# EAGLE design S151A (EAGLE 6.6.0)
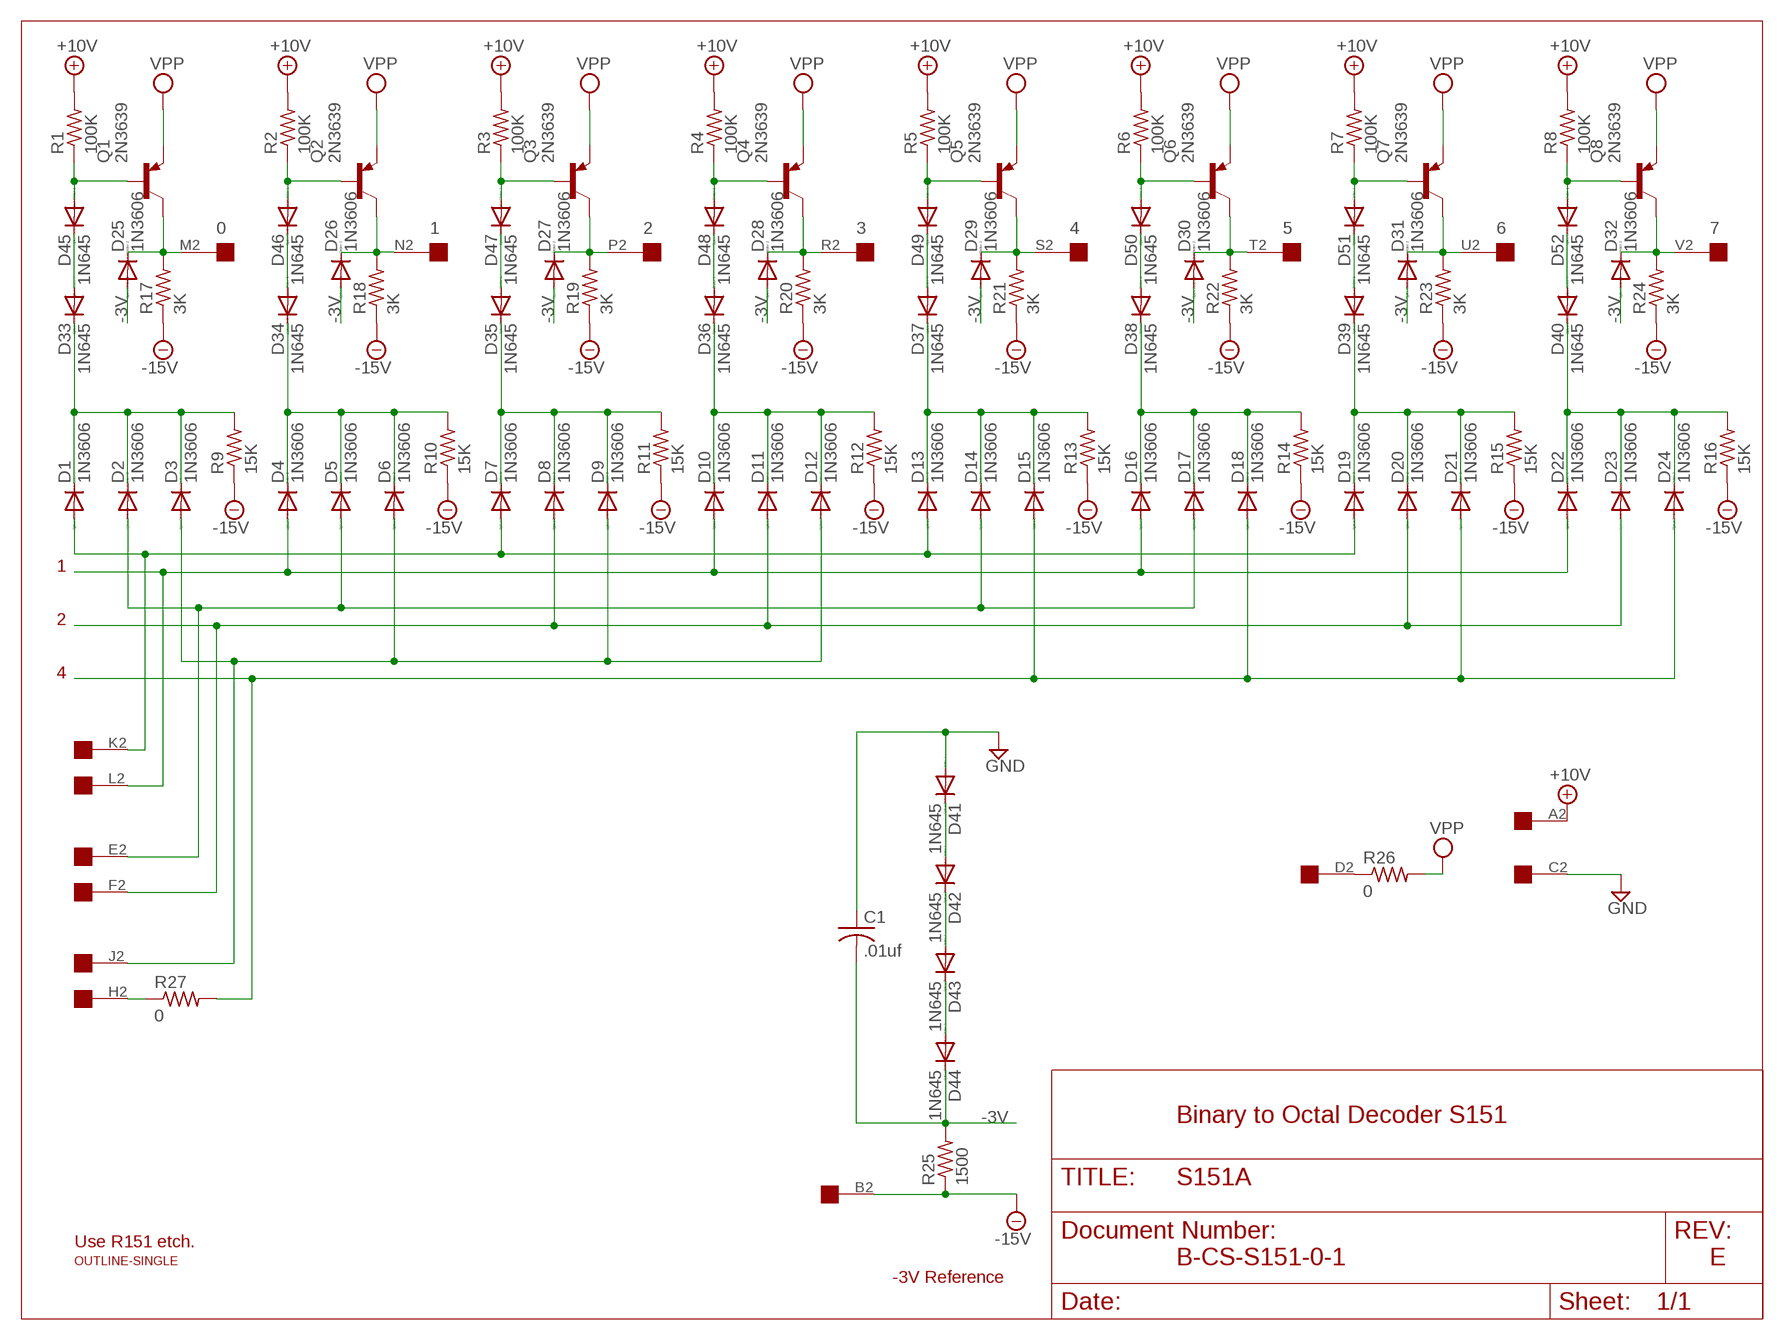
[diagram p0: schematic, sheet 1]

## Parts
C1  .01uf  C-US050-025X075  [C050-025X075]
D1  1N3606  1N4148DO35-10  [DO35-10]
D2  1N3606  1N4148DO35-10  [DO35-10]
D3  1N3606  1N4148DO35-10  [DO35-10]
D4  1N3606  1N4148DO35-10  [DO35-10]
D5  1N3606  1N4148DO35-10  [DO35-10]
D6  1N3606  1N4148DO35-10  [DO35-10]
D7  1N3606  1N4148DO35-10  [DO35-10]
D8  1N3606  1N4148DO35-10  [DO35-10]
D9  1N3606  1N4148DO35-10  [DO35-10]
D10  1N3606  1N4148DO35-10  [DO35-10]
D11  1N3606  1N4148DO35-10  [DO35-10]
D12  1N3606  1N4148DO35-10  [DO35-10]
D13  1N3606  1N4148DO35-10  [DO35-10]
D14  1N3606  1N4148DO35-10  [DO35-10]
D15  1N3606  1N4148DO35-10  [DO35-10]
D16  1N3606  1N4148DO35-10  [DO35-10]
D17  1N3606  1N4148DO35-10  [DO35-10]
D18  1N3606  1N4148DO35-10  [DO35-10]
D19  1N3606  1N4148DO35-10  [DO35-10]
D20  1N3606  1N4148DO35-10  [DO35-10]
D21  1N3606  1N4148DO35-10  [DO35-10]
D22  1N3606  1N4148DO35-10  [DO35-10]
D23  1N3606  1N4148DO35-10  [DO35-10]
D24  1N3606  1N4148DO35-10  [DO35-10]
D25  1N3606  1N4148DO35-10  [DO35-10]
D26  1N3606  1N4148DO35-10  [DO35-10]
D27  1N3606  1N4148DO35-10  [DO35-10]
D28  1N3606  1N4148DO35-10  [DO35-10]
D29  1N3606  1N4148DO35-10  [DO35-10]
D30  1N3606  1N4148DO35-10  [DO35-10]
D31  1N3606  1N4148DO35-10  [DO35-10]
D32  1N3606  1N4148DO35-10  [DO35-10]
D33  1N645  1N4148DO35-10  [DO35-10]
D34  1N645  1N4148DO35-10  [DO35-10]
D35  1N645  1N4148DO35-10  [DO35-10]
D36  1N645  1N4148DO35-10  [DO35-10]
D37  1N645  1N4148DO35-10  [DO35-10]
D38  1N645  1N4148DO35-10  [DO35-10]
D39  1N645  1N4148DO35-10  [DO35-10]
D40  1N645  1N4148DO35-10  [DO35-10]
D41  1N645  1N4148DO35-10  [DO35-10]
D42  1N645  1N4148DO35-10  [DO35-10]
D43  1N645  1N4148DO35-10  [DO35-10]
D44  1N645  1N4148DO35-10  [DO35-10]
D45  1N645  1N4148DO35-10  [DO35-10]
D46  1N645  1N4148DO35-10  [DO35-10]
D47  1N645  1N4148DO35-10  [DO35-10]
D48  1N645  1N4148DO35-10  [DO35-10]
D49  1N645  1N4148DO35-10  [DO35-10]
D50  1N645  1N4148DO35-10  [DO35-10]
D51  1N645  1N4148DO35-10  [DO35-10]
D52  1N645  1N4148DO35-10  [DO35-10]
Q1  2N3639  2N3637  [TO39]
Q2  2N3639  2N3637  [TO39]
Q3  2N3639  2N3637  [TO39]
Q4  2N3639  2N3637  [TO39]
Q5  2N3639  2N3637  [TO39]
Q6  2N3639  2N3637  [TO39]
Q7  2N3639  2N3637  [TO39]
Q8  2N3639  2N3637  [TO39]
R1  100K  R-US_0207/10  [0207/10]
R2  100K  R-US_0207/10  [0207/10]
R3  100K  R-US_0207/10  [0207/10]
R4  100K  R-US_0207/10  [0207/10]
R5  100K  R-US_0207/10  [0207/10]
R6  100K  R-US_0207/10  [0207/10]
R7  100K  R-US_0207/10  [0207/10]
R8  100K  R-US_0207/10  [0207/10]
R9  15K  R-US_0207/10  [0207/10]
R10  15K  R-US_0207/10  [0207/10]
R11  15K  R-US_0207/10  [0207/10]
R12  15K  R-US_0207/10  [0207/10]
R13  15K  R-US_0207/10  [0207/10]
R14  15K  R-US_0207/10  [0207/10]
R15  15K  R-US_0207/10  [0207/10]
R16  15K  R-US_0207/10  [0207/10]
R17  3K  R-US_0207/10  [0207/10]
R18  3K  R-US_0207/10  [0207/10]
R19  3K  R-US_0207/10  [0207/10]
R20  3K  R-US_0207/10  [0207/10]
R21  3K  R-US_0207/10  [0207/10]
R22  3K  R-US_0207/10  [0207/10]
R23  3K  R-US_0207/10  [0207/10]
R24  3K  R-US_0207/10  [0207/10]
R25  1500  R-US_0207/10  [0207/10]
R26  0  R-US_0207/10  [0207/10]
R27  0  R-US_0207/10  [0207/10]
U$1  OUTLINE-SINGLE  [SINGLE]
U$2  EDGE-1  [EDGE-CON1]

## Nets
0: D25.C Q1.3(C) R17.2 U$2.M2
1: D26.C Q2.3(C) R18.2 U$2.N2
2: D27.C Q3.3(C) R19.2 U$2.P2
3: D28.C Q4.3(C) R20.2 U$2.R2
4: D29.C Q5.3(C) R21.2 U$2.S2
5: D30.C Q6.3(C) R22.2 U$2.T2
6: D31.C Q7.3(C) R23.2 U$2.U2
7: D32.C Q8.3(C) R24.2 U$2.V2
!D0: D1.A D7.A D13.A D19.A U$2.K2
!D1: D2.A D5.A D14.A D17.A U$2.E2
!D2: D3.A D6.A D9.A D12.A U$2.J2
+10V [Power]: R1.2 R2.2 R3.2 R4.2 R5.2 R6.2 R7.2 R8.2 U$2.A2
-3V [Power]: C1.2 D25.A D26.A D27.A D28.A D29.A D30.A D31.A D32.A D44.C R25.2
-15V [Power]: R9.1 R10.1 R11.1 R12.1 R13.1 R14.1 R15.1 R16.1 R17.1 R18.1 R19.1 R20.1 R21.1 R22.1 R23.1 R24.1 R25.1 U$2.B2
D0: D4.A D10.A D16.A D22.A U$2.L2
D1: D8.A D11.A D20.A D23.A U$2.F2
D2: D15.A D18.A D21.A D24.A R27.2
GND [Power]: C1.1 D41.A U$2.C2
N$2: D46.A Q2.2(B) R2.1
N$3: D41.C D42.A
N$4: R26.1 U$2.D2
N$5: R27.1 U$2.H2
N$6: D4.C D5.C D6.C D34.C R10.2
N$7: D34.A D46.C
N$8: D47.A Q3.2(B) R3.1
N$11: D7.C D8.C D9.C D35.C R11.2
N$12: D35.A D47.C
N$13: D42.C D43.A
N$16: D43.C D44.A
N$18: D48.A Q4.2(B) R4.1
N$19: D45.A Q1.2(B) R1.1
N$22: D1.C D2.C D3.C D33.C R9.2
N$23: D33.A D45.C
N$26: D10.C D11.C D12.C D36.C R12.2
N$27: D36.A D48.C
N$33: D49.A Q5.2(B) R5.1
N$34: D13.C D14.C D15.C D37.C R13.2
N$35: D37.A D49.C
N$36: D50.A Q6.2(B) R6.1
N$37: D16.C D17.C D18.C D38.C R14.2
N$38: D38.A D50.C
N$40: D51.A Q7.2(B) R7.1
N$41: D19.C D20.C D21.C D39.C R15.2
N$42: D39.A D51.C
N$44: D52.A Q8.2(B) R8.1
N$45: D22.C D23.C D24.C D40.C R16.2
N$46: D40.A D52.C
VPP [Power]: Q1.1(E) Q2.1(E) Q3.1(E) Q4.1(E) Q5.1(E) Q6.1(E) Q7.1(E) Q8.1(E) R26.2

## Notes on the sheet
- 1
- 2
- 4
- Binary to Octal Decoder S151
- Use R151 etch.
- B-CS-S151-0-1 | E
- -3V Reference

## Library data of the parts
C1 = rcl:C-US: CAPACITOR, American symbol
D1-D52 = diode:1N4148: DIODE high speed (Philips)
Q1-Q8 = transistor-pnp:2N3637*: PNP Transistror
R1-R27 = rcl:R-US_: RESISTOR, American symbol
U$1 = dec-con:OUTLINE-*: Board outlines for DEC boards.
U$2 = dec-con:EDGE-1: Single-Sided DEC Edge Connector -- (side 2)

## Net classes
1 Power: width 0.813 mm

## Board
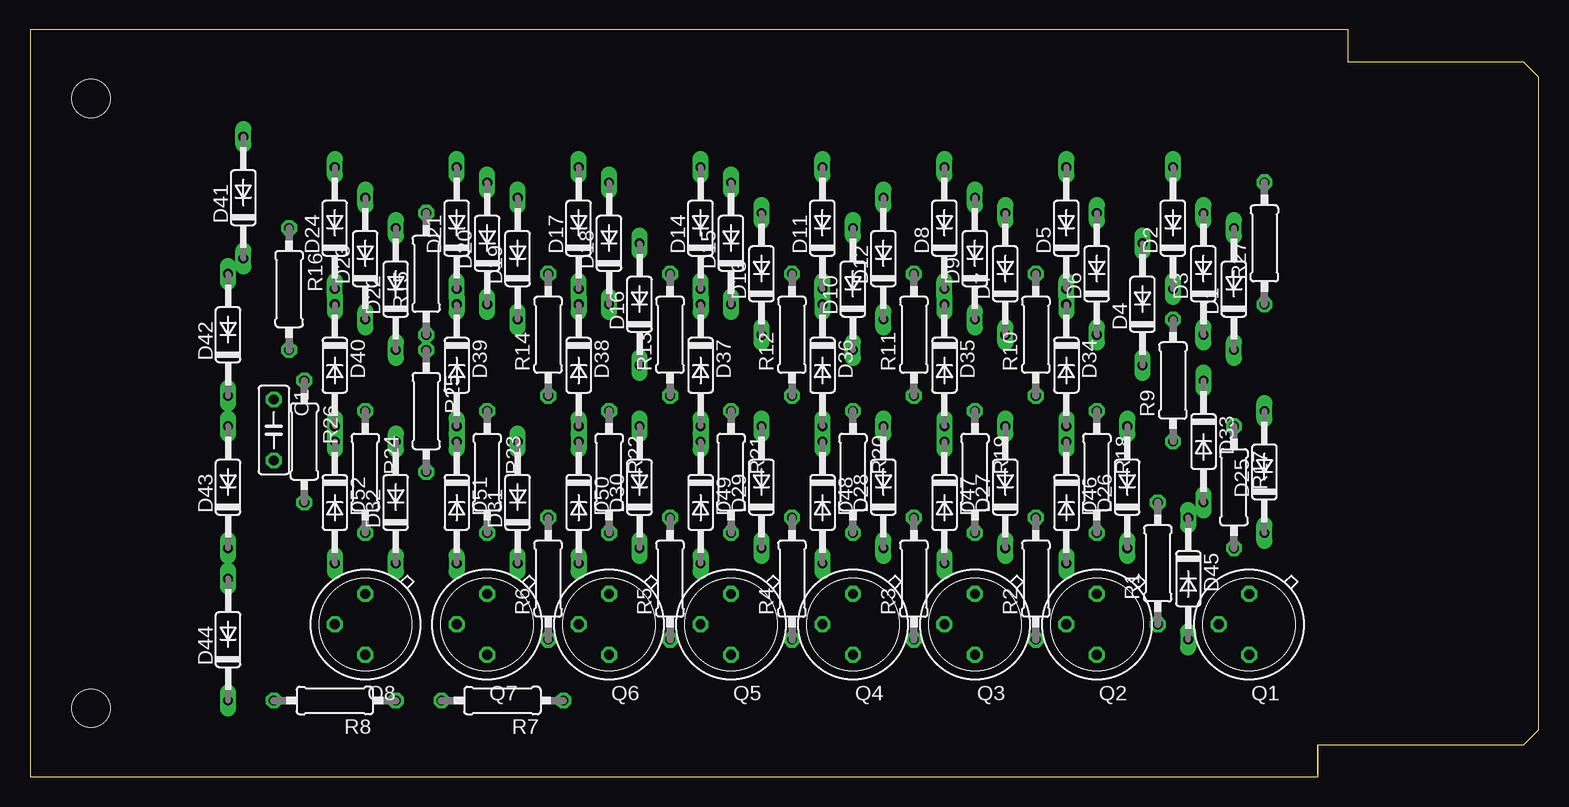
[diagram p1: board, top side]
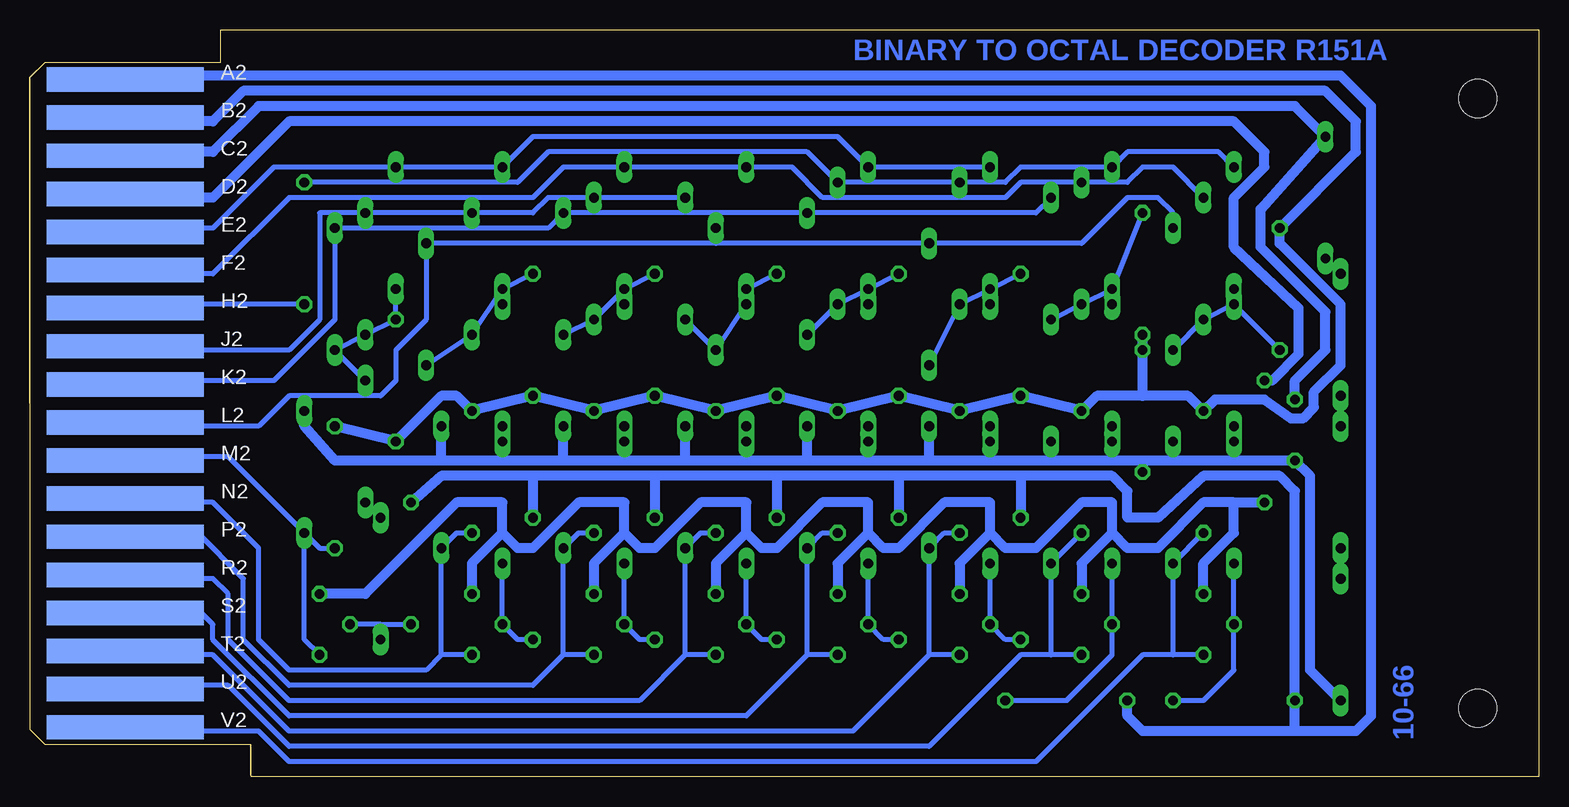
[diagram p2: board, bottom side, seen from below]

Size 125.73 x 62.23 mm. Coordinates in mm from the lower left corner, seen from the top.
Copper layers (1+16): Top 0.035mm / dielectric 1.5mm / Bottom 0.035mm
Design rules "16mils": minimum track width 16mil, minimum drill 32mil, track to track 15mil, track to pad 10mil, pad to pad 10mil, via to via 10mil, smd to smd 10mil, copper to edge 13mil, drill to drill 10mil, minimum pad ring 10mil, minimum via ring 8mil, stop-mask expansion 0mil, vias tented up to drill 0mil, thermal gap 10mil

### Footprints (pad centres in the part's own frame; a part is rotated, then mirrored left to right if it is on the bottom)
C050-025X075 = drill 0.813 octagon: 1 -2.54,0; 2 2.54,0
DO35-10 = drill 0.813 long: A 5.08,0; C -5.08,0
TO39 = drill 0.813 octagon: 1 0,-2.54; 2 2.54,0; 3 0,2.54
0207/10 = drill 0.813 octagon: 1 -5.08,0; 2 5.08,0
SINGLE = hole 3.175: 120.65,56.515; 120.65,5.715
EDGE-CON1 = smd 13.106 x 2.032 bottom: A2 7.938,4.128; B2 7.938,7.303; C2 7.938,10.477; D2 7.938,13.652; E2 7.938,16.828; F2 7.938,20.003; H2 7.938,23.177; J2 7.938,26.352; K2 7.938,29.527; L2 7.938,32.703; M2 7.938,35.877; N2 7.938,39.053; P2 7.938,42.227; R2 7.938,45.403; S2 7.938,48.578; T2 7.938,51.752; U2 7.938,54.928; V2 7.938,58.102

### Placement (x,y rotation side)
C1  20.32,28.89 270 top
D1  100.33,40.64 90 top
D2  95.25,45.72 90 top
D3  97.79,41.91 90 top
D4  92.71,39.37 90 top
D5  86.36,45.72 90 top
D6  88.9,41.91 90 top
D7  81.28,41.91 90 top
D8  76.2,45.72 90 top
D9  78.74,43.18 90 top
D10  68.58,40.64 90 top
D11  66.04,45.72 90 top
D12  71.12,43.18 90 top
D13  60.96,41.91 90 top
D14  55.88,45.72 90 top
D15  58.42,44.45 90 top
D16  50.8,39.37 90 top
D17  45.72,45.72 90 top
D18  48.26,44.45 90 top
D19  40.64,43.18 90 top
D20  38.1,44.45 90 top
D21  35.56,45.72 90 top
D22  30.48,40.64 90 top
D23  27.94,43.18 90 top
D24  25.4,45.72 90 top
D25  102.87,25.4 90 top
D26  91.44,24.13 90 top
D27  81.28,24.13 90 top
D28  71.12,24.13 90 top
D29  60.96,24.13 90 top
D30  50.8,24.13 90 top
D31  40.64,22.86 90 top
D32  30.48,22.86 90 top
D33  97.79,27.94 270 top
D34  86.36,34.29 270 top
D35  76.2,34.29 270 top
D36  66.04,34.29 270 top
D37  55.88,34.29 270 top
D38  45.72,34.29 270 top
D39  35.56,34.29 270 top
D40  25.4,34.29 270 top
D41  17.78,48.26 90 top
D42  16.51,36.83 90 top
D43  16.51,24.13 90 top
D44  16.51,11.43 90 top
D45  96.52,16.51 270 top
D46  86.36,22.86 270 top
D47  76.2,22.86 270 top
D48  66.04,22.86 270 top
D49  55.88,22.86 270 top
D50  45.72,22.86 270 top
D51  35.56,22.86 270 top
D52  25.4,22.86 270 top
Q1  101.6,12.7 180 top
Q2  88.9,12.7 180 top
Q3  78.74,12.7 180 top
Q4  68.58,12.7 180 top
Q5  58.42,12.7 180 top
Q6  48.26,12.7 180 top
Q7  38.1,12.7 180 top
Q8  27.94,12.7 180 top
R1  93.98,17.78 90 top
R2  83.82,16.51 90 top
R3  73.66,16.51 90 top
R4  63.5,16.51 90 top
R5  53.34,16.51 90 top
R6  43.18,16.51 90 top
R7  39.37,6.35 180 top
R8  25.4,6.35 180 top
R9  95.25,33.02 90 top
R10  83.82,36.83 90 top
R11  73.66,36.83 90 top
R12  63.5,36.83 90 top
R13  53.34,36.83 90 top
R14  43.18,36.83 90 top
R15  33.02,41.91 90 top
R16  21.59,40.64 270 top
R17  100.33,24.13 270 top
R18  88.9,25.4 270 top
R19  78.74,25.4 270 top
R20  68.58,25.4 270 top
R21  58.42,25.4 270 top
R22  48.26,25.4 270 top
R23  38.1,25.4 270 top
R24  27.94,25.4 270 top
R25  33.02,30.48 270 top
R26  22.86,27.94 270 top
R27  102.87,44.45 90 top
U$1  125.73,62.23 180 top
U$2  125.73,62.23 180 top

### Tracks (layer width: path | path; a pad name or v marks a point on that pad's centre or on a via)
0
  Bottom 0.406: Q1.3 102.87,11.43 D25.C | R17.2 101.6,19.05 D25.C | U$2.M2 117.17,26.34 116.84,26.67 109.22,26.67 D25.C
1
  Bottom 0.406: R18.2 90.17,20.32 D26.C 91.44,10.16 | Q2.3 91.44,10.16 | U$2.N2 117.17,23.19 116.84,22.86 110.49,22.86 106.68,19.05 106.68,11.43 104.14,8.89 92.71,8.89 91.44,10.16
2
  Bottom 0.406: U$2.P2 117.17,19.99 116.84,20.32 111.76,20.32 107.95,16.51 107.95,11.43 104.14,7.62 83.82,7.62 81.28,10.16 | 81.28,10.16 D27.C 80.01,20.32 R19.2 | Q3.3 81.28,10.16
3
  Bottom 0.406: U$2.R2 117.17,16.84 116.84,16.51 110.49,16.51 109.22,15.24 109.22,11.43 104.14,6.35 74.93,6.35 71.12,10.16 | R20.2 69.85,20.32 D28.C 71.12,10.16 | Q4.3 71.12,10.16
4
  Bottom 0.406: Q5.3 60.96,10.16 | 60.96,10.16 D29.C 59.69,20.32 R21.2 | U$2.S2 117.14,13.66 116.84,13.97 111.76,13.97 110.49,12.7 110.49,11.43 104.14,5.08 66.04,5.08 60.96,10.16
5
  Bottom 0.406: Q6.3 50.8,10.16 | 50.8,10.16 D30.C 49.53,20.32 R22.2 | U$2.T2 117.17,10.49 116.84,10.16 110.49,10.16 104.14,3.81 57.15,3.81 50.8,10.16
6
  Bottom 0.406: R23.2 D31.C 40.64,10.16 | Q7.3 40.64,10.16 | U$2.U2 117.2,7.26 116.84,7.62 109.22,7.62 104.14,2.54 50.8,2.54 43.18,10.16 40.64,10.16
7
  Bottom 0.406: U$2.V2 117.16,4.13 116.84,3.81 106.68,3.81 104.14,1.27 41.91,1.27 33.02,10.16 30.48,10.16 | Q8.3 30.48,10.16 | R24.2 D32.C 30.48,10.16
!D0
  Bottom 0.406: U$2.K2 117.14,32.72 116.84,33.02 105.41,33.02 100.33,38.1 D1.A 82.55,45.72 D7.A D13.A 41.91,46.99 D19.A
!D1
  Bottom 0.406: U$2.E2 117.71,45.72 110.49,45.72 105.41,50.8 D2.A D5.A 83.82,53.34 58.42,53.34 D14.A D17.A
!D2
  Bottom 0.406: U$2.J2 116.84,35.56 104.14,35.56 101.6,38.1 101.6,46.99 D3.A D6.A 83.82,46.99 82.55,48.26 D9.A D12.A
+10V
  Bottom 0.813: U$2.A2 116.84,58.04 116.84,58.42 16.51,58.42 13.97,55.88 13.97,5.08 15.24,3.81 20.32,3.81 | 20.32,3.81 R8.2 20.32,23.81 21.59,25.08 27.94,25.08 31.75,21.59 34.29,21.59 34.29,23.81 35.56,25.08 43.18,25.08 | R7.2 34.29,5.08 33.02,3.81 20.32,3.81 | 43.18,25.08 R6.2 | R1.2 91.44,25.08 83.82,25.08 | 53.34,25.08 63.5,25.08 | 63.5,25.08 73.66,25.08 | 73.66,25.08 83.82,25.08 | 43.18,25.08 53.34,25.08 | 53.34,25.08 R5.2 | 63.5,25.08 R4.2 | 73.66,25.08 R3.2 | 83.82,25.08 R2.2
-3V
  Bottom 0.813: 30.48,26.35 C1.2 19.05,25.08 19.05,8.89 D44.C | 30.48,26.35 33.02,26.35 | 33.02,26.35 40.64,26.35 | 40.64,26.35 D31.A | 30.48,26.35 D32.A | 33.02,26.35 R25.2 | 91.44,26.35 D26.A | 40.64,26.35 50.8,26.35 | 50.8,26.35 60.96,26.35 | 60.96,26.35 71.12,26.35 | 71.12,26.35 81.28,26.35 | 81.28,26.35 91.44,26.35 | 50.8,26.35 D30.A | 60.96,26.35 D29.A | 71.12,26.35 D28.A | 81.28,26.35 D27.A | D25.A 102.87,29.21 100.33,26.35 91.44,26.35
-15V
  Bottom 0.813: U$2.B2 117.13,54.9 116.84,54.61 110.49,54.61 107.95,57.15 17.78,57.15 15.24,54.61 15.24,52.07 R16.1 21.59,44.45 16.51,39.37 16.51,34.29 18.73,32.07 18.73,30.8 19.68,29.84 20.64,29.84 22.86,31.43 26.99,31.43 R24.1 29.21,31.75 33.02,31.75 | 33.02,31.75 R25.1 R15.1 | 33.02,31.75 36.83,31.75 R23.1 R14.1 R22.1 R13.1 R21.1 R12.1 R20.1 R11.1 R19.1 R10.1 R18.1 90.17,31.75 91.44,31.75 R9.1 R17.1
D0
  Bottom 0.406: U$2.L2 117.17,29.54 116.84,29.21 106.68,29.21 104.14,31.75 96.52,31.75 95.25,33.02 95.25,35.56 92.71,38.1 D4.A 68.58,44.45 | 68.58,44.45 D10.A | 68.58,44.45 D16.A 38.1,44.45 34.29,48.26 31.75,48.26 30.48,46.99 D22.A
D1
  Bottom 0.406: U$2.F2 116.84,41.91 110.49,41.91 104.14,48.26 83.82,48.26 81.28,50.8 D8.A D11.A 62.23,50.8 59.69,48.26 44.45,48.26 43.18,49.53 D20.A 34.29,49.53 33.02,50.8 30.48,50.8 D23.A
D2
  Bottom 0.406: D24.A 26.67,52.07 34.29,52.07 D21.A 43.18,50.8 44.45,49.53 D18.A D15.A 60.96,52.07 82.55,52.07 85.09,49.53 R27.2
GND
  Bottom 0.813: U$2.C2 117.73,52.07 110.49,52.07 106.68,55.88 20.32,55.88 D41.A 23.18,47.31 23.18,44.13 17.78,38.73 17.78,35.56 20.32,33.02 C1.1
N$2
  Bottom 0.406: R2.1 85.09,11.43 Q2.2 D46.A
N$3
  Bottom 0.406: D42.A D41.C
N$4
  Bottom 0.813: U$2.D2 117.73,48.26 110.49,48.26 104.14,54.61 25.4,54.61 22.86,52.07 22.86,50.8 25.4,48.26 25.4,44.13 20,39.05 20,35.24 22.23,33.02 R26.1
N$5
  Bottom 0.406: U$2.H2 116.84,39.37 R27.1
N$6
  Bottom 0.406: D4.C D6.C D5.C | D5.C D34.C | D5.C R10.2
N$7
  Bottom 0.406: D46.C D34.A
N$8
  Bottom 0.406: R3.1 74.93,11.43 Q3.2 D47.A
N$11
  Bottom 0.406: D7.C D9.C D8.C | D8.C D35.C | R11.2 D8.C
N$12
  Bottom 0.406: D47.C D35.A
N$13
  Bottom 0.406: D43.A D42.C
N$16
  Bottom 0.406: D44.A D43.C
N$18
  Bottom 0.406: R4.1 64.77,11.43 Q4.2 D48.A
N$19
  Bottom 0.406: 96.52,12.7 R1.1 | 96.52,12.7 Q1.2 | D45.A 96.52,12.7
N$22
  Bottom 0.406: D2.C R9.2 D3.C D1.C D33.C
N$23
  Bottom 0.406: D45.C D33.A
N$26
  Bottom 0.406: R12.2 D11.C D36.C D10.C D12.C
N$27
  Bottom 0.406: D48.C D36.A
N$33
  Bottom 0.406: R5.1 54.61,11.43 Q5.2 D49.A
N$34
  Bottom 0.406: D14.C D37.C | R13.2 D14.C | D13.C D15.C D14.C
N$35
  Bottom 0.406: D49.C D37.A
N$36
  Bottom 0.406: R6.1 44.45,11.43 Q6.2 D50.A
N$37
  Bottom 0.406: D17.C R14.2 | D17.C D18.C D16.C | D17.C D38.C
N$38
  Bottom 0.406: D50.C D38.A
N$40
  Bottom 0.406: R7.1 39.37,6.35 35.56,10.16 Q7.2 D51.A
N$41
  Bottom 0.406: D21.C D20.C D19.C | D39.C D21.C | D21.C R15.2
N$42
  Bottom 0.406: D51.C D39.A
N$44
  Bottom 0.406: R8.1 27.94,6.35 25.4,8.89 Q8.2 D52.A
N$45
  Bottom 0.406: D40.C D24.C D40.C | D40.C D23.C D22.C | R16.2 D40.C
N$46
  Bottom 0.406: D52.C D40.A
VPP
  Bottom 0.813: Q8.1 27.94,17.78 25.4,20.32 25.4,22.86 | Q1.1 97.79,15.24 90.17,22.86 86.36,22.86 86.36,20.32 | 86.36,20.32 88.9,17.78 Q2.1 | Q3.1 78.74,17.78 76.2,20.32 | 76.2,20.32 76.2,22.86 80.01,22.86 83.82,19.05 85.09,19.05 86.36,20.32 | 76.2,20.32 74.93,19.05 73.66,19.05 69.85,22.86 66.04,22.86 66.04,20.32 | 66.04,20.32 68.58,17.78 Q4.1 | Q5.1 58.42,17.78 55.88,20.32 | 55.88,20.32 55.88,22.86 59.69,22.86 63.5,19.05 64.77,19.05 66.04,20.32 | Q6.1 48.26,17.78 45.72,20.32 | 45.72,20.32 45.72,22.86 49.53,22.86 53.34,19.05 54.61,19.05 55.88,20.32 | Q7.1 38.1,17.78 35.56,20.32 | 35.56,20.32 35.56,22.86 38.1,22.86 41.91,19.05 44.45,19.05 45.72,20.32 | 35.56,20.32 34.29,19.05 31.75,19.05 27.94,22.86 25.4,22.86 | 25.4,22.86 R26.2

### Text on the board
Bottom: BINARY TO OCTAL DECODER R151A | 10-66
200bmp: C:/Users/Vince/Documents/websvn/trunk/Eagle/projects/DEC/Rxxx/R151/R151Afront.bmp